# Altium schematic sheet 触摸4B.SCHDOC
size A4; PageSetup: Record=PageOptions|CenterHorizontal=True|CenterVertical=True|PrintScale=0.96|XCorrection=1.00|YCorrection=1.00|PrintKind=2|BorderSize=5000000|LeftOffset=0|BottomOffset=0|Orientation=2|PaperLength=1000|PaperWidth=1000|Scale=100|PaperSource=7|PrintQuality=-4|MediaType=1|DitherType=10|PaperKind=A4|PrintScaleMode=1
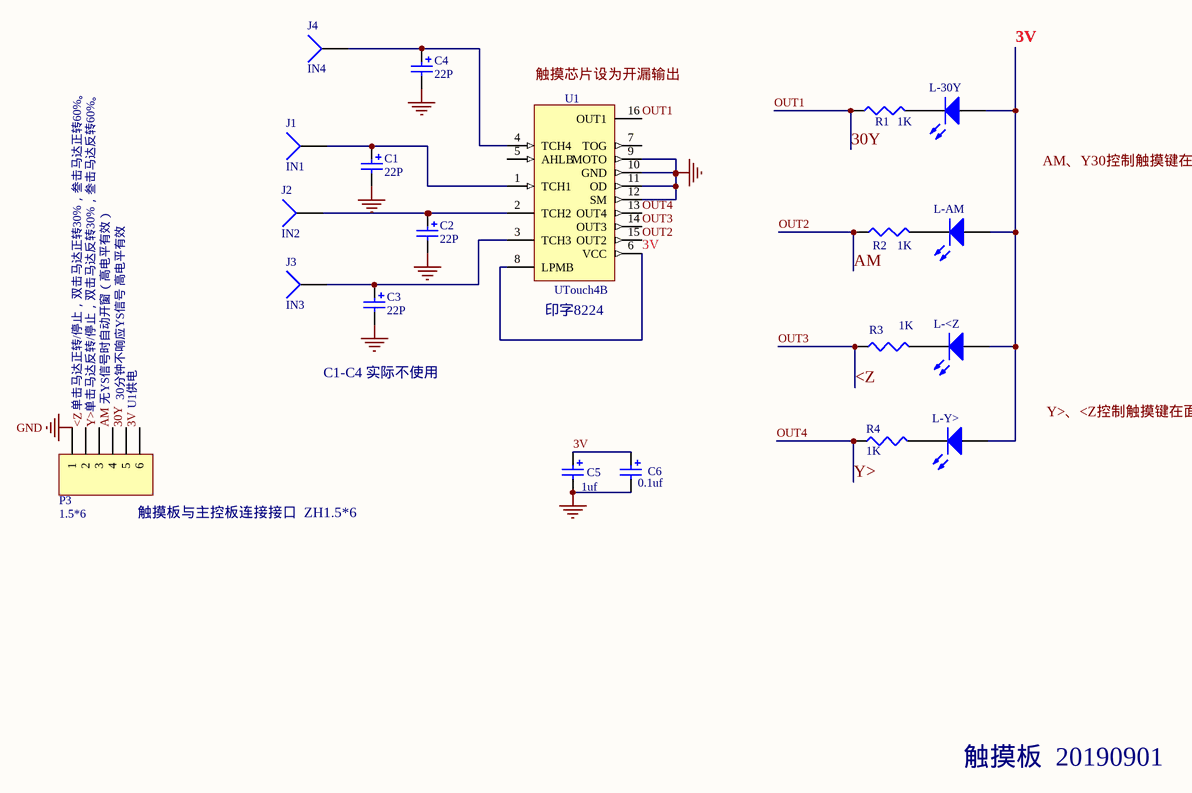
[diagram p0: 触摸4B.SCHDOC]

## Parts
C1  value 22P  [CC2012-0805]
C2  value 22P  [CC2012-0805]
C3  value 22P  [CC2012-0805]
C4  value 22P  [CC2012-0805]
C5  1uf  [CC2012-0805]
C6  0.1uf  [CC2012-0805]
J1  IN1  [PIN1]
J2  IN2  [PIN1]
J3  IN3  [PIN1]
J4  IN4  [PIN1]
L-30Y  (no value)  [SMD _LED]
L-<Z  (no value)  [SMD _LED]
L-AM  (no value)  [SMD _LED]
L-Y>  (no value)  [SMD _LED]
P3  1.5*6  [MHDR1X6]
R1  1K  [C1608-0603]
R2  1K  [C1608-0603]
R3  value 1K  [C1608-0603]
R4  1K  [C1608-0603]
U1  UTouch4B  [TSSO5x6-G16]

## Nets
GND: C1.2 C2.2 C3.2 C4.2 C5.2 C6.2 P3.1 U1.9(MOTO) U1.10(GND) U1.11(OD) U1.12(SM)
3V: C5.1 C6.1 L-30Y.1(A) L-<Z.1(A) L-AM.1(A) L-Y>.1(A) P3.6 U1.6(VCC) U1.8(LPMB)
30Y: P3.5 R1.1 U1.16(OUT1)  [also labelled OUT1]
<Z: P3.2 R3.1 U1.14(OUT3)  [also labelled OUT3]
AM: P3.4 R2.1 U1.15(OUT2)  [also labelled OUT2]
OUT4: P3.3 R4.1 U1.13(OUT4)  [also labelled Y>]
NetC1_1: C1.1 J1.1 U1.1(TCH1)
NetC2_1: C2.1 J2.1 U1.2(TCH2)
NetC3_1: C3.1 J3.1 U1.3(TCH3)
NetC4_1: C4.1 J4.1 U1.4(TCH4)
NetL-30Y_2: L-30Y.2(K) R1.2
NetL-<Z_2: L-<Z.2(K) R3.2
NetL-AM_2: L-AM.2(K) R2.2
NetL-Y>_2: L-Y>.2(K) R4.2

Not connected (* = marked no-connect by the designer): U1 5(AHLB) 7(TOG)

## Notes on the sheet
- (near U1) 印字8224
- (near P3) 单击马达正转/停止，双击马达正转30%，叁击马达正转60%。
- (near P3) 单击马达反转/停止，双击马达反转30%，叁击马达反转60%。
- (near P3) 无YS信号时自动开窗（高电平有效）
- 30分钟不响应YS信号 高电平有效
- (near P3) U1供电
- C1-C4 实际不使用
- (near P3) 触摸板与主控板连接接口  ZH1.5*6
- 触摸板  20190901
- Labels drawn without touching a wire or pin: AM、Y30控制触摸键在面板上方, Y>、<Z控制触摸键在面板下方, 触摸芯片设为开漏输出

## Library data of the parts
C1-C6 = Cap Pol3: Polarized Capacitor (Surface Mount); Published: 8-Jun-2000; LatestRevisionDate: 17-Jul-2002; LatestRevisionNote: Re-released for DXP Platform.; Publisher: Altium Limited; PackageReference: C0805
J1-J4 = Socket: LatestRevisionDate: 17-Jul-2002; LatestRevisionNote: Re-released for DXP Platform.; Publisher: Altium Limited
L-30Y L-<Z L-AM L-Y> = LED3: Typical BLUE SiC LED; Published: 8-Jun-2000; LatestRevisionDate: 17-Dec-2003; LatestRevisionNote: PCB Footprint replaced.; Publisher: Altium Limited
P3 = MHDR1X6: Header, 6-Pin; LatestRevisionDate: 17-Jul-2002; LatestRevisionNote: Re-released for DXP Platform.; Publisher: Altium Limited
R1-R4 = Res3: Resistor; Published: 8-Jun-2000; LatestRevisionDate: 17-Jul-2002; LatestRevisionNote: Re-released for DXP Platform.; Publisher: Altium Limited
U1 = ADC-8: Generic 8-Bit A/D Converter; Published: 8-Jun-2000; LatestRevisionDate: 17-Jul-2002; LatestRevisionNote: Re-released for DXP Platform.; Publisher: Altium Limited; Code_JEDEC: MO-153-AB